# EAGLE design watch (EAGLE 5.11)
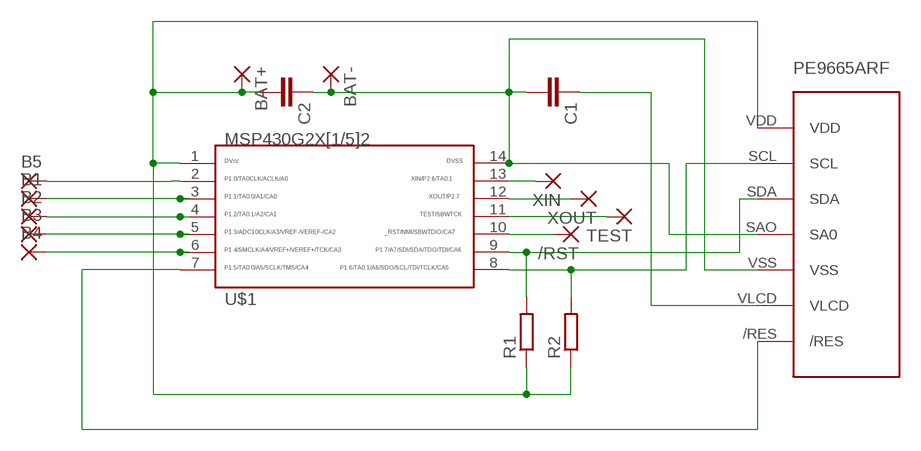
[diagram p0: schematic, sheet 1]

## Parts
/RST  SMD2  [SMD1,27-2,54]
B1  SMD2  [SMD1,27-2,54]
B2  SMD2  [SMD1,27-2,54]
B3  SMD2  [SMD1,27-2,54]
B4  SMD2  [SMD1,27-2,54]
B5  SMD2  [SMD1,27-2,54]
BAT+  SMD2  [SMD1,27-2,54]
BAT-  SMD2  [SMD1,27-2,54]
C1  C-EUC1206  [C1206]
C2  C-EUC1206  [C1206]
R1  R-EU_M1206  [M1206]
R2  R-EU_M1206  [M1206]
TEST  SMD2  [SMD1,27-2,54]
U$1  G2X[1/5]2---PW14  [PW14]
U$2  PE9665ARF  [PE9665ARF]
XIN  SMD2  [SMD1,27-2,54]
XOUT  SMD2  [SMD1,27-2,54]

## Nets
N$1: B1.1(P) U$1.3
N$2: R2.2 U$1.8 U$2.SCL
N$3: R1.2 U$1.9 U$2.SDA
N$4: B2.1(P) U$1.4
N$5: C1.1 U$2.VLCD
N$6: U$1.7 U$2./RES
N$7: /RST.1(P) U$1.10
N$8: TEST.1(P) U$1.11
N$9: U$1.13 XIN.1(P)
N$10: U$1.12 XOUT.1(P)
N$11: B3.1(P) U$1.5
N$12: B5.1(P) U$1.2
N$13: B4.1(P) U$1.6
VCC: BAT+.1(P) C2.2 R1.1 R2.1 U$1.1 U$2.VDD
VSS: BAT-.1(P) C1.2 C2.1 U$1.14 U$2.SAO(SA0) U$2.VSS

## Library data of the parts
/RST B1-B5 BAT+ BAT- TEST XIN XOUT = wirepad:SMD2: SMD PAD
C1 C2 = rcl:C-EU: CAPACITOR, European symbol
R1 R2 = resistor:R-EU_: RESISTOR, European symbol
U$1 = TI_MSP430_v16:G2X[1/5]2---PW14: MSP430G2X[1/5]2 MSP430G2x52, MSP430G2x12 TSSOP (PW) 14 Pin Package http://focus.ti.com/docs/prod/folders/print/msp430g2452.html
U$2 = apus:PE9665ARF

## Board
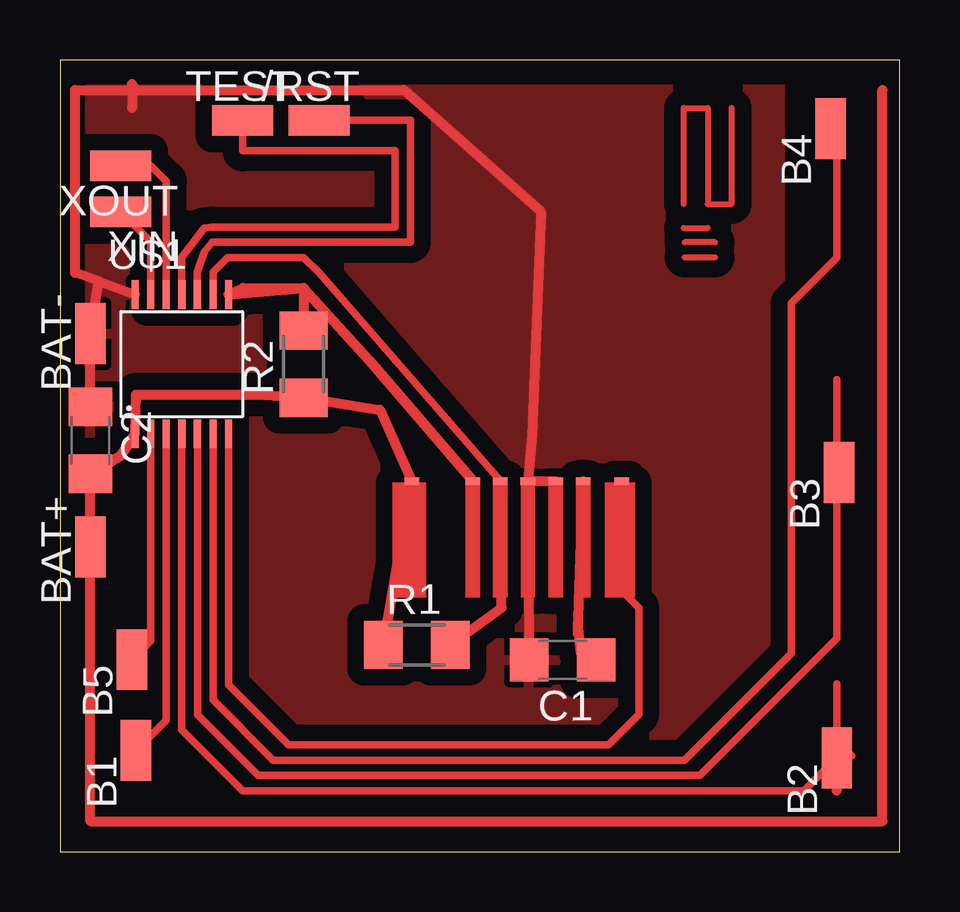
[diagram p1: board, top side]

Size 35 x 33 mm. Coordinates in mm from the lower left corner, seen from the top.
Outline: 0,0 35,0 35,33 0,33 0,0
Copper layers (1*16): Top 0.035mm / dielectric 1.5mm / Bottom 0.035mm
Design rules "default": minimum track width 10mil, minimum drill 24mil, track to track 8mil, track to pad 8mil, pad to pad 8mil, via to via 8mil, smd to smd 8mil, copper to edge 40mil, drill to drill 8mil, minimum pad ring 10mil, minimum via ring 8mil, stop-mask expansion 4mil, vias tented up to drill 0mil, thermal gap 10mil

### Footprints (pad centres in the part's own frame; a part is rotated, then mirrored left to right if it is on the bottom)
SMD1,27-2,54 = smd 1.27 x 2.54: 1 0,0
C1206 = smd 1.6 x 1.8: 1 -1.4,0; 2 1.4,0
M1206 = smd 1.6 x 2: 1 -1.4,0; 2 1.4,0
PW14 = smd 0.3 x 1.2: 1 -1.95,-2.9; 2 -1.3,-2.9; 3 -0.65,-2.9; 4 0,-2.9; 5 0.65,-2.9; 6 1.3,-2.9; 7 1.95,-2.9; 8 1.95,2.9; 9 1.3,2.9; 10 0.65,2.9; 11 0,2.9; 12 -0.65,2.9; 13 -1.3,2.9; 14 -1.95,2.9
PE9665ARF = smd 0.61 x 0.305: /RES 6.5,4.85; SAO 2.6,4.85; SCL 0.3,4.85; SDA 1.45,4.85; VDD -2.25,4.85; VLCD 4.9,4.85; VSS 3.75,4.85

### Placement (x,y rotation side)
/RST  10.79,30.48 270 top
B1  3.17,4.21 0 top
B2  32.38,3.9 0 top
B3  32.48,15.81 0 top
B4  32.13,30.14 0 top
B5  3,8 0 top
BAT+  1.27,12.7 0 top
BAT-  1.27,21.59 0 top
C1  20.95,7.99 180 top
C2  1.27,17.14 270 top
R1  14.88,8.62 0 top
R2  10.16,20.32 90 top
TEST  7.62,30.48 270 top
U$1  5.08,20.32 0 top
U$2  16.91,10.59 0 top
XIN  2.54,26.67 90 top
XOUT  2.54,28.57 90 top

### Tracks (layer width: path | path; a pad name or v marks a point on that pad's centre or on a via)
N$1
  Top 0.305: U$1.3 4.43,5.46 B1.1
N$2
  Top 0.406: 10.16,23.5 7.62,23.5 U$1.8 10.16,23.5 | 10.16,23.5 12.88,20.5 U$2.SCL | 10.16,23.5 R2.2
N$3
  Top 0.305: U$1.9 6.38,24.16 6.99,24.77 10.16,24.77 10.79,24.13 U$2.SDA
  Top 0.406: R1.2 18.41,10.16 U$2.SDA
N$4
  Top 0.305: U$1.4 5.08,5.08 7.62,2.54 31.02,2.54 B2.1 | 32.38,2.54 32.38,4.62 | 32.38,4.62 32.38,6.99 | 32.38,4.62 33,4
  Top 0.406: B2.1 32.38,2.54
N$5
  Top 0.406: U$2.VLCD 21.59,9.09 21.59,9.53 21.72,8.26 C1.1
N$6
  Top 0.305: U$1.7 7.03,6.94 9.53,4.45 22.86,4.45 24.13,5.71 24.13,10.16 23.5,10.79 23.5,15.36 U$2./RES
N$7
  Top 0.305: /RST.1 14.61,30.48 14.61,25.4 6.35,25.4 6,25 5.71,24.13 U$1.10
N$8
  Top 0.305: TEST.1 7.62,29.21 13.97,29.21 13.97,26.04 6.35,26.04 6,26 5.08,24.77 U$1.11
N$9
  Top 0.305: U$1.13 3.78,25.43 XIN.1
N$10
  Top 0.305: U$1.12 4.43,27.95 3.81,28.57 XOUT.1
N$11
  Top 0.305: U$1.5 5.73,5.7 8.26,3.17 26.67,3.17 32.38,8.89 32.38,15.9 | 32.38,15.9 32.38,19.68 | 32.38,15.9 B3.1
N$12
  Top 0.305: U$1.2 3.78,8.78 B5.1
N$13
  Top 0.305: U$1.6 6.38,6.32 8.89,3.81 26.04,3.81 30.48,8.26 30.48,22.86 32.38,24.77 32.38,29.89 B4.1
N$16
  Top 0.254: 28,31 28,27 27,27 27,31 26,31 26,27
N$17
  Top 0.254: 26,26 27,26
N$18
  Top 0.254: 27.3,25.4 26.04,25.4
N$19
  Top 0.254: 27.3,24.77 26.04,24.77
VCC
  Top 0.406: R1.1 U$2.VDD 13.34,18.41 R2.1 8.26,19.05 3.17,19.05 U$1.1 2.54,16.51 C2.2 BAT+.1 1.27,1.27 34.29,1.27 34.29,31.75
VSS
  Top 0.406: U$2.SAO U$2.VSS | U$2.SAO 19.68,17.34 20.05,26.67 14.34,31.75 3.17,31.75 | 1.6,23.78 0.64,24.13 0.64,31.75 3.17,31.75 | 1.6,23.78 U$1.14 | U$2.SAO C1.2 | C2.1 BAT-.1 1.6,23.78 | 3,31.93 3,31 | 3,31.93 3,32 | 3.17,31.75 3,31.93
  pour Top (isolate 0.7): 0,33 30,33 30,0 0,0